# EAGLE design Nanocopter (EAGLE 6.1)
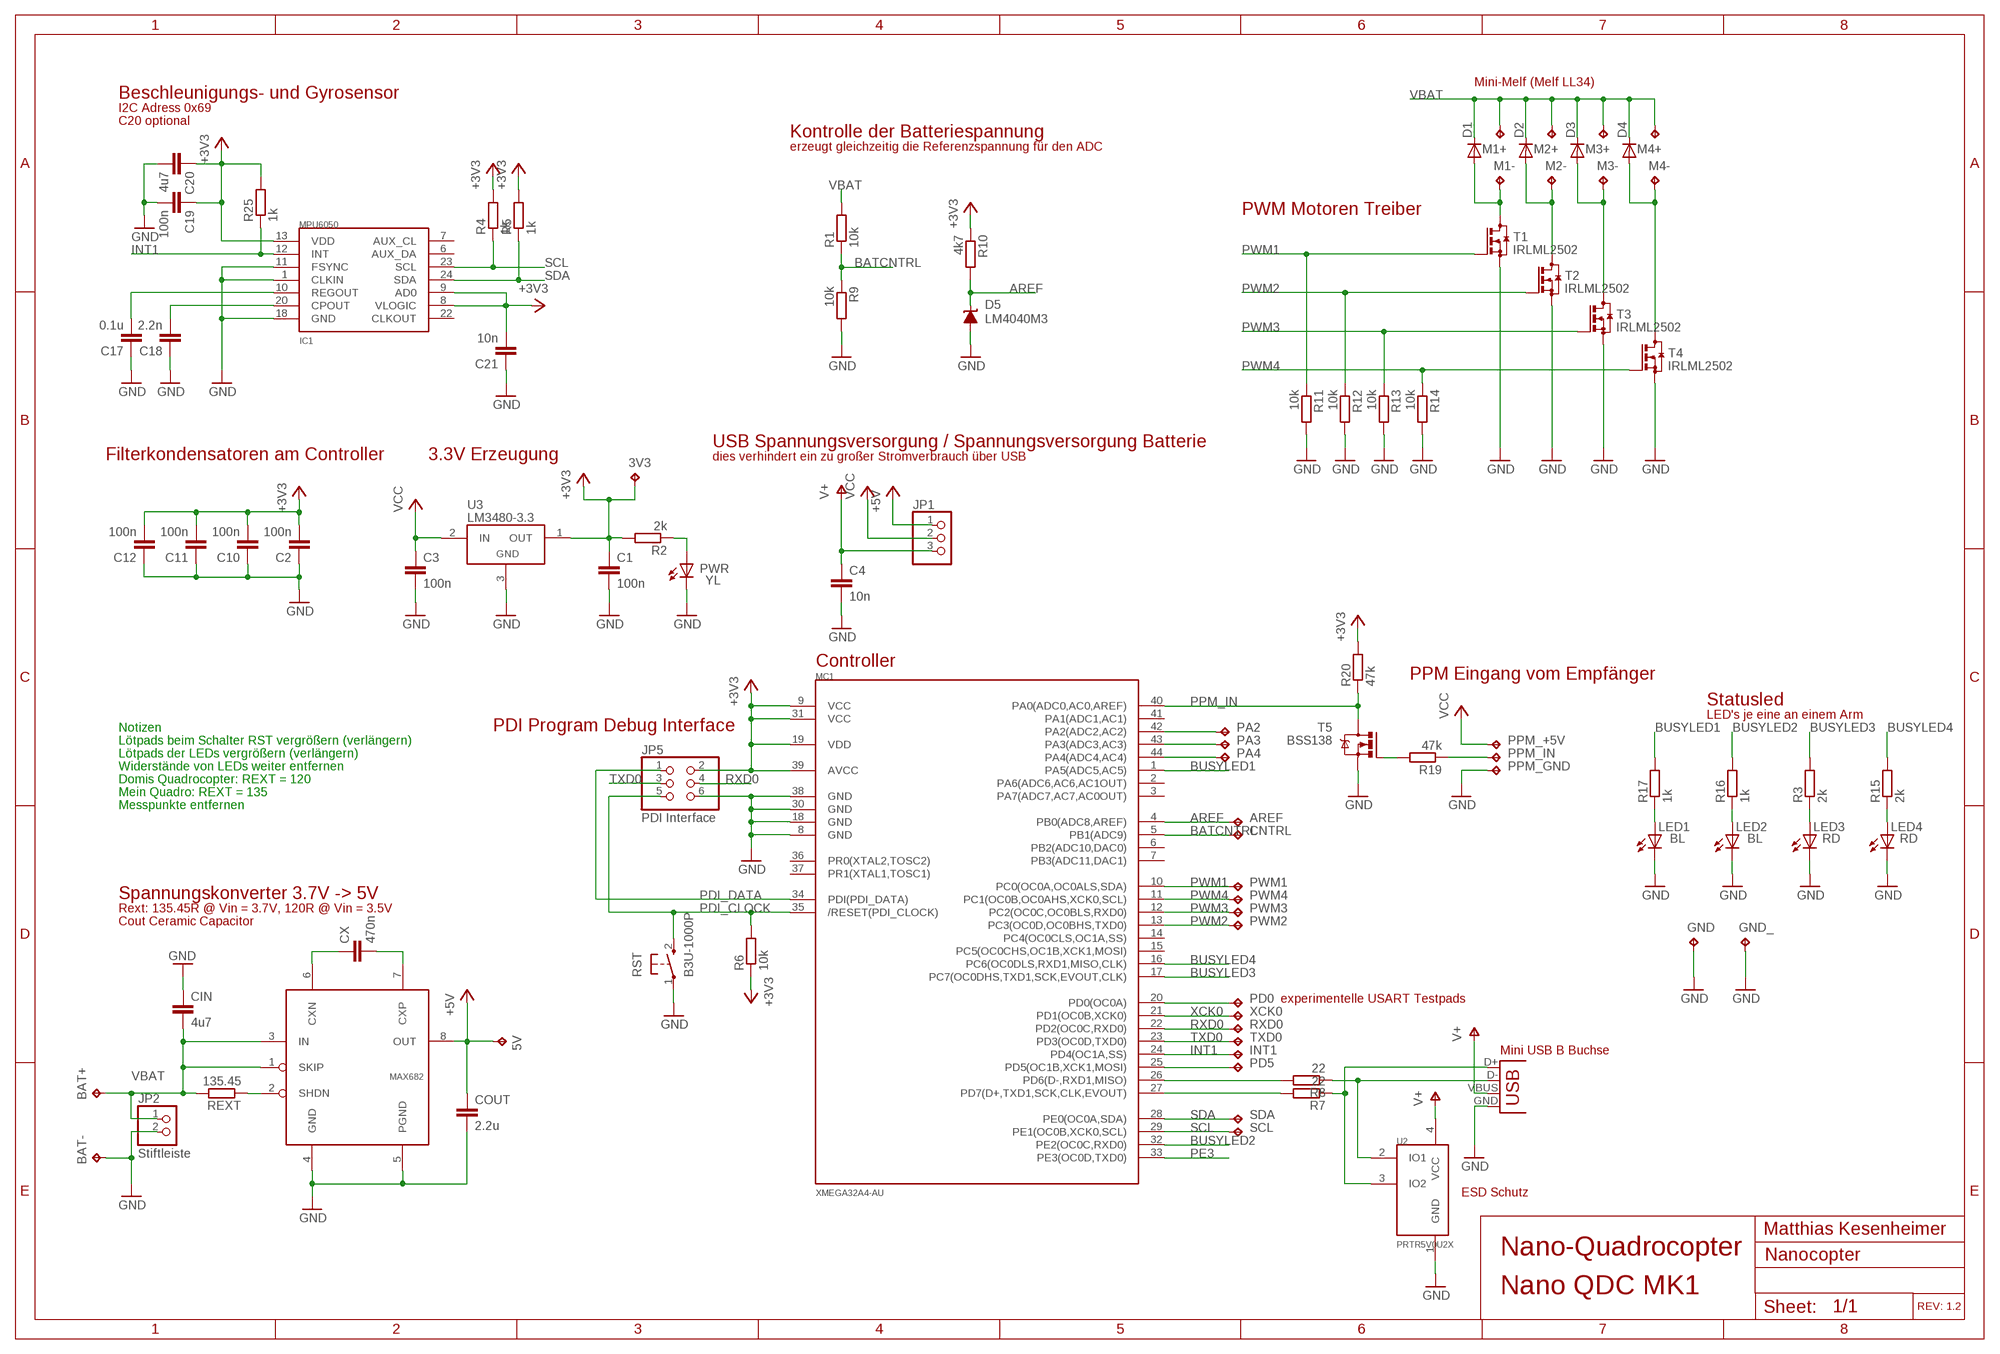
[diagram p0: schematic, sheet 1]

## Parts
3V3  TPTP12SQ  [TP12SQ]
5V  TPTP12SQ  [TP12SQ]
AREF  TPTP10SQ  [TP10SQ]
BAT+  TPTP12SQ  [TP12SQ]
BAT-  TPTP12SQ  [TP12SQ]
C1  100n  C-EUC0603  [C0603]
C2  100n  C-EUC0603  [C0603]
C3  100n  C-EUC0603  [C0603]
C4  10n  C-EUC0603  [C0603]
C10  100n  C-EUC0603  [C0603]
C11  100n  C-EUC0603  [C0603]
C12  100n  C-EUC0603  [C0603]
C17  0.1u  C-EUC0603  [C0603]
C18  2.2n  C-EUC0603  [C0603]
C19  100n  C-EUC0603  [C0603]
C20  4u7  C-EUC0603  [C0603]
C21  10n  C-EUC0603  [C0603]
CIN  4u7  C-EUC1206  [C1206]
CNTRL  TPTP10SQ  [TP10SQ]
COUT  2.2u  C-EUC1206  [C1206]
CX  470n  C-EUC0603  [C0603]
D1  DIODE-MINIMELF  [MINIMELF]
D2  DIODE-MINIMELF  [MINIMELF]
D3  DIODE-MINIMELF  [MINIMELF]
D4  DIODE-MINIMELF  [MINIMELF]
D5  LM4040M3  [SOT-23]
GND  TPTP12SQ  [TP12SQ]
GND_  TPTP12SQ  [TP12SQ]
IC1  MPU6050  [QFN-24]
INT1  TPTP10SQ  [TP10SQ]
JP1  PINHD-1X3  [1X03]
JP2  Stiftleiste  PINHD-1X2  [1X02]
JP5  PDI Interface  PINHD-2X3  [2X03]
LED1  BL  LEDCHIPLED_0603  [CHIPLED_0603]
LED2  BL  LEDCHIPLED_0603  [CHIPLED_0603]
LED3  RD  LEDCHIPLED_0603  [CHIPLED_0603]
LED4  RD  LEDCHIPLED_0603  [CHIPLED_0603]
M1+  TPTP15SQ  [TP15SQ]
M1-  TPTP15SQ  [TP15SQ]
M2+  TPTP15SQ  [TP15SQ]
M2-  TPTP15SQ  [TP15SQ]
M3+  TPTP15SQ  [TP15SQ]
M3-  TPTP15SQ  [TP15SQ]
M4+  TPTP15SQ  [TP15SQ]
M4-  TPTP15SQ  [TP15SQ]
MC1  XMEGA32A4-AU  [TQFP44]
PA2  TPTP10SQ  [TP10SQ]
PA3  TPTP10SQ  [TP10SQ]
PA4  TPTP10SQ  [TP10SQ]
PD0  TPTP10SQ  [TP10SQ]
PD5  TPTP10SQ  [TP10SQ]
PPM_+5V  TPTP10SQ  [TP10SQ]
PPM_GND  TPTP10SQ  [TP10SQ]
PPM_IN  TPTP10SQ  [TP10SQ]
PWM1  TPTP10SQ  [TP10SQ]
PWM2  TPTP10SQ  [TP10SQ]
PWM3  TPTP10SQ  [TP10SQ]
PWM4  TPTP10SQ  [TP10SQ]
PWR  YL  LEDCHIPLED_0603  [CHIPLED_0603]
R1  10k  R-EU_R0603  [R0603]
R2  2k  R-EU_R0603  [R0603]
R3  2k  R-EU_R0603  [R0603]
R4  1k  R-EU_R0603  [R0603]
R5  1k  R-EU_R0603  [R0603]
R6  10k  R-EU_R0603  [R0603]
R7  22  R-EU_R0603  [R0603]
R8  22  R-EU_R0603  [R0603]
R9  10k  R-EU_R0603  [R0603]
R10  4k7  R-EU_R0603  [R0603]
R11  10k  R-EU_R0603  [R0603]
R12  10k  R-EU_R0603  [R0603]
R13  10k  R-EU_R0603  [R0603]
R14  10k  R-EU_R0603  [R0603]
R15  2k  R-EU_R0603  [R0603]
R16  1k  R-EU_R0603  [R0603]
R17  1k  R-EU_R0603  [R0603]
R19  47k  R-EU_R0603  [R0603]
R20  47k  R-EU_R0603  [R0603]
R25  1k  R-EU_R0603  [R0603]
REXT  135.45  R-EU_R0603  [R0603]
RST  B3U-1000P  [SW_SMD]
RXD0  TPTP10SQ  [TP10SQ]
SCL  TPTP10SQ  [TP10SQ]
SDA  TPTP10SQ  [TP10SQ]
T1  IRLML2502  BSS123  [SOT23]
T2  IRLML2502  BSS123  [SOT23]
T3  IRLML2502  BSS123  [SOT23]
T4  IRLML2502  BSS123  [SOT23]
T5  BSS138  [SOT23]
TXD0  TPTP10SQ  [TP10SQ]
U1  MAX682  [SOIC(N)8]
U2  PRTR5V0U2X  [SOT143B]
U3  LM3480-3.3  [SOT-23-3]
X1  USBSMD  [USB-MINIB]
XCK0  TPTP10SQ  [TP10SQ]

## Nets
+3V3: 3V3.TP C1.1 C2.2 C10.2 C11.2 C12.2 C19.1 C20.1 C21.2 IC1.8(VLOGIC) IC1.9(AD0) IC1.13(VDD) JP5.2 MC1.9(VCC) MC1.19(VDD) MC1.31(VCC) MC1.39(AVCC) R2.2 R4.2 R5.2 R6.1 R10.1 R20.2 R25.2 U3.1(OUT)
+5V: 5V.TP COUT.1 JP1.1 U1.8(OUT)
AREF: AREF.TP D5.1(C) MC1.4(PB0(ADC8,AREF)) R10.2
BATCNTRL: CNTRL.TP MC1.5(PB1(ADC9)) R1.1 R9.1
BUSYLED1: MC1.1(PA5(ADC5,AC5)) R17.2
BUSYLED2: MC1.32(PE2(OC0C,RXD0)) R16.2
BUSYLED3: MC1.17(PC7(OC0DHS,TXD1,SCK,EVOUT,CLK)) R3.2
BUSYLED4: MC1.16(PC6(OC0DLS,RXD1,MISO,CLK)) R15.2
D+: MC1.27(PD7(D+,TXD1,SCK,CLK,EVOUT)) R7.2
D-: MC1.26(PD6(D-,RXD1,MISO)) R8.2
GND: BAT-.TP C1.2 C2.1 C3.2 C4.2 C10.1 C11.1 C12.1 C17.1 C18.1 C19.2 C20.2 C21.1 CIN.1 COUT.2 D5.2(A) GND.TP GND_.TP IC1.1(CLKIN) IC1.11(FSYNC) IC1.18(GND) JP2.2 JP5.6 LED1.C LED2.C LED3.C LED4.C MC1.8(GND) MC1.18(GND) MC1.30(GND) MC1.38(GND) PPM_GND.TP PWR.C R9.2 R11.2 R12.2 R13.2 R14.2 RST.1 T1.2(S) T2.2(S) T3.2(S) T4.2(S) T5.2(S) U1.4(GND) U1.5(PGND) U2.1(GND) U3.3(GND) X1.GND
INT1: IC1.12(INT) INT1.TP MC1.24(PD4(OC1A,SS)) R25.1
N$2: R19.2 T5.1(G)
N$3: PPM_IN.TP R19.1
N$4: MC1.44(PA4(ADC4,AC4)) PA4.TP
N$6: CX.1 U1.6(CXN)
N$7: MC1.43(PA3(ADC3,AC3)) PA3.TP
N$8: MC1.42(PA2(ADC2,AC2)) PA2.TP
N$9: PWR.A R2.1
N$10: LED3.A R3.1
N$11: REXT.1 U1.2(SHDN)
N$13: CX.2 U1.7(CXP)
N$15: LED4.A R15.1
N$17: LED2.A R16.1
N$18: LED1.A R17.1
N$19: D1.A M1-.TP T1.3(D)
N$21: D3.A M3-.TP T3.3(D)
N$22: D4.A M4-.TP T4.3(D)
N$26: C17.2 IC1.10(REGOUT)
N$27: C18.2 IC1.20(CPOUT)
N$30: D2.A M2-.TP T2.3(D)
N$35: MC1.20(PD0(OC0A)) PD0.TP
N$36: MC1.25(PD5(OC1B,XCK1,MOSI)) PD5.TP
PDI_CLOCK: JP5.5 MC1.35(/RESET(PDI_CLOCK)) R6.2 RST.2
PDI_DATA: JP5.1 MC1.34(PDI(PDI_DATA))
PE3: MC1.33(PE3(OC0D,TXD0))
PPM_IN: MC1.40(PA0(ADC0,AC0,AREF)) R20.1 T5.3(D)
PWM1: MC1.10(PC0(OC0A,OC0ALS,SDA)) PWM1.TP R11.1 T1.1(G)
PWM2: MC1.13(PC3(OC0D,OC0BHS,TXD0)) PWM2.TP R12.1 T2.1(G)
PWM3: MC1.12(PC2(OC0C,OC0BLS,RXD0)) PWM3.TP R13.1 T3.1(G)
PWM4: MC1.11(PC1(OC0B,OC0AHS,XCK0,SCL)) PWM4.TP R14.1 T4.1(G)
RXD0: JP5.4 MC1.22(PD2(OC0C,RXD0)) RXD0.TP
SCL: IC1.23(SCL) MC1.29(PE1(OC0B,XCK0,SCL)) R4.1 SCL.TP
SDA: IC1.24(SDA) MC1.28(PE0(OC0A,SDA)) R5.1 SDA.TP
TXD0: JP5.3 MC1.23(PD3(OC0D,TXD0)) TXD0.TP
USB+: R7.1 U2.3(IO2) X1.D+
USB-: R8.1 U2.2(IO1) X1.D-
V+: C4.1 JP1.3 U2.4(VCC) X1.VBUS
VBAT: BAT+.TP CIN.2 D1.C D2.C D3.C D4.C JP2.1 M1+.TP M2+.TP M3+.TP M4+.TP R1.2 REXT.2 U1.1(SKIP) U1.3(IN)
VCC: C3.1 JP1.2 PPM_+5V.TP U3.2(IN)
XCK0: MC1.21(PD1(OC0B,XCK0)) XCK0.TP
Unconnected: IC1.6(AUX_DA) IC1.7(AUX_CL) IC1.22(CLKOUT) MC1.2(PA6(ADC6,AC6,AC1OUT)) MC1.3(PA7(ADC7,AC7,AC0OUT)) MC1.6(PB2(ADC10,DAC0)) MC1.7(PB3(ADC11,DAC1)) MC1.14(PC4(OC0CLS,OC1A,SS)) MC1.15(PC5(OC0CHS,OC1B,XCK1,MOSI)) MC1.36(PR0(XTAL2,TOSC2)) MC1.37(PR1(XTAL1,TOSC1)) MC1.41(PA1(ADC1,AC1))

## Notes on the sheet
- Mini-Melf (Melf LL34)
- Beschleunigungs- und Gyrosensor
- I2C Adress 0x69
- C20 optional
- Kontrolle der Batteriespannung
- erzeugt gleichzeitig die Referenzspannung für den ADC
- PWM Motoren Treiber
- USB Spannungsversorgung / Spannungsversorgung Batterie
- Filterkondensatoren am Controller | 3.3V Erzeugung | dies verhindert ein zu großer Stromverbrauch über USB
- Controller
- PPM Eingang vom Empfänger
- Statusled
- LED's je eine an einem Arm
- Notizen | PDI Program Debug Interface
- Lötpads beim Schalter RST vergrößern (verlängern)
- Lötpads der LEDs vergrößern (verlängern)
- Widerstände von LEDs weiter entfernen
- Domis Quadrocopter: REXT = 120
- Mein Quadro: REXT = 135
- Messpunkte entfernen
- Spannungskonverter 3.7V -> 5V
- Rext: 135.45R @ Vin = 3.7V, 120R @ Vin = 3.5V
- Cout Ceramic Capacitor
- experimentelle USART Testpads
- Mini USB B Buchse
- ESD Schutz
- Matthias Kesenheimer
- Nano-Quadrocopter
- Nano QDC MK1
- REV: 1.2

## Library data of the parts
3V3 5V AREF BAT+ BAT- CNTRL GND GND_ INT1 M1+ M1- M2+ M2- M3+ M3- M4+ M4- PA2-PA4 PD0 PD5 PPM_+5V PPM_GND PPM_IN PWM1-PWM4 RXD0 SCL SDA TXD0 XCK0 = testpad:TP: Test pad
C1-C4 C10-C12 C17-C21 CIN COUT CX = rcl:C-EU: CAPACITOR, European symbol
D1-D4 = diode:DIODE-: DIODE
D5 = texas:LM4040M3
IC1 = SparkFun:MPU6050
JP1 = pinhead:PINHD-1X3: PIN HEADER
JP2 = pinhead:PINHD-1X2: PIN HEADER
JP5 = pinhead:PINHD-2X3: PIN HEADER
LED1-LED4 PWR = led:LED: LED OSRAM: - CHIPLED LG R971, LG N971, LY N971, LG Q971, LY Q971, LO R971, LY R971 LH N974, LH R974 LS Q976, LO Q976, LY Q976 LO Q996 - Hyper CHIPLED LW Q18S LB Q993, LB Q99A, LB R99A - SideLED LS A670, LO A670, LY A670, LG A670, LP A670 LB A673, LV A673, LT A673, LW A673 LH A674 LY A675 LS A676, LA A676, LO A676, LY A676, LW A676 LS A679, LY A679, LG A679 - Hyper Micro SIDELED® LS Y876, LA Y876, LO Y876, LY Y876 LT Y87S - SmartLED LW L88C, LW L88S LB L89C, LB L89S, LG L890 LS L89K, LO L89K, LY L89K LS L896, LA L896, LO L896, LY L896 - TOPLED LS T670, LO T670, LY T670, LG T670, LP T670 LSG T670, LSP T670, LSY T670, LOP T670, LYG T670 LG T671, LOG T671, LSG T671 LB T673, LV T673, LT T673, LW T673 LH T674 LS T676, LA T676, LO T676, LY T676, LB T676, LH T676, LSB T676, LW T676 LB T67C, LV T67C, LT T67C, LS T67K, LO T67K, LY T67K, LW E67C LS E67B, LA E67B, LO E67B, LY E67B, LB E67C, LV E67C, LT E67C LW T67C LS T679, LY T679, LG T679 LS T770, LO T770, LY T770, LG T770, LP T770 LB T773, LV T773, LT T773, LW T773 LH T774 LS E675, LA E675, LY E675, LS T675 LS T776, LA T776, LO T776, LY T776, LB T776 LHGB T686 LT T68C, LB T68C - Hyper Mini TOPLED® LB M676 - Mini TOPLED Santana® LG M470 LS M47K, LO M47K, LY M47K Source: http://www.osram.convergy.de LUXEON: - LUMILED® LXK2-PW12-R00, LXK2-PW12-S00, LXK2-PW14-U00, LXK2-PW14-V00 LXK2-PM12-R00, LXK2-PM12-S00, LXK2-PM14-U00 LXK2-PE12-Q00, LXK2-PE12-R00, LXK2-PE12-S00, LXK2-PE14-T00, LXK2-PE14-U00 LXK2-PB12-K00, LXK2-PB12-L00, LXK2-PB12-M00, LXK2-PB14-N00, LXK2-PB14-P00, LXK2-PB14-Q00 LXK2-PR12-L00, LXK2-PR12-M00, LXK2-PR14-Q00, LXK2-PR14-R00 LXK2-PD12-Q00, LXK2-PD12-R00, LXK2-PD12-S00 LXK2-PH12-R00, LXK2-PH12-S00 LXK2-PL12-P00, LXK2-PL12-Q00, LXK2-PL12-R00 Source: www.luxeon.com KINGBRIGHT: KA-3528ASYC Source: www.kingbright.com
MC1 = atmel:XMEGA32A4-AU
R1-R17 R19 R20 R25 REXT = rcl:R-EU_: RESISTOR, European symbol
RST = Omron:B3U-1000P
T1-T4 = transistor-small-signal:BSS123: N-CHANNEL MOS FET
T5 = mylib:BSS138
U1 = maxim:MAX682
U2 = Philips:PRTR5V0U2X
U3 = regulators:LM3480-*: National Semiconductor LM3480 100 mA, SOT-23, quasi-LDO linear regulator
X1 = SparkFun:USB: USB Connectors USB-B-PTH is fully proven SKU : PRT-00139 USB-miniB is fully proven SKU : PRT-00587 USB-A-PCB is untested. USB-A-H is throughly reviewed, but untested. Spark Fun Electronics SKU : PRT-00437 USB-B-SMT is throughly reviewed, but untested. Needs silkscreen touching up. USB-A-S has not been used/tested USB-MB-H has not been used/tested

## Board
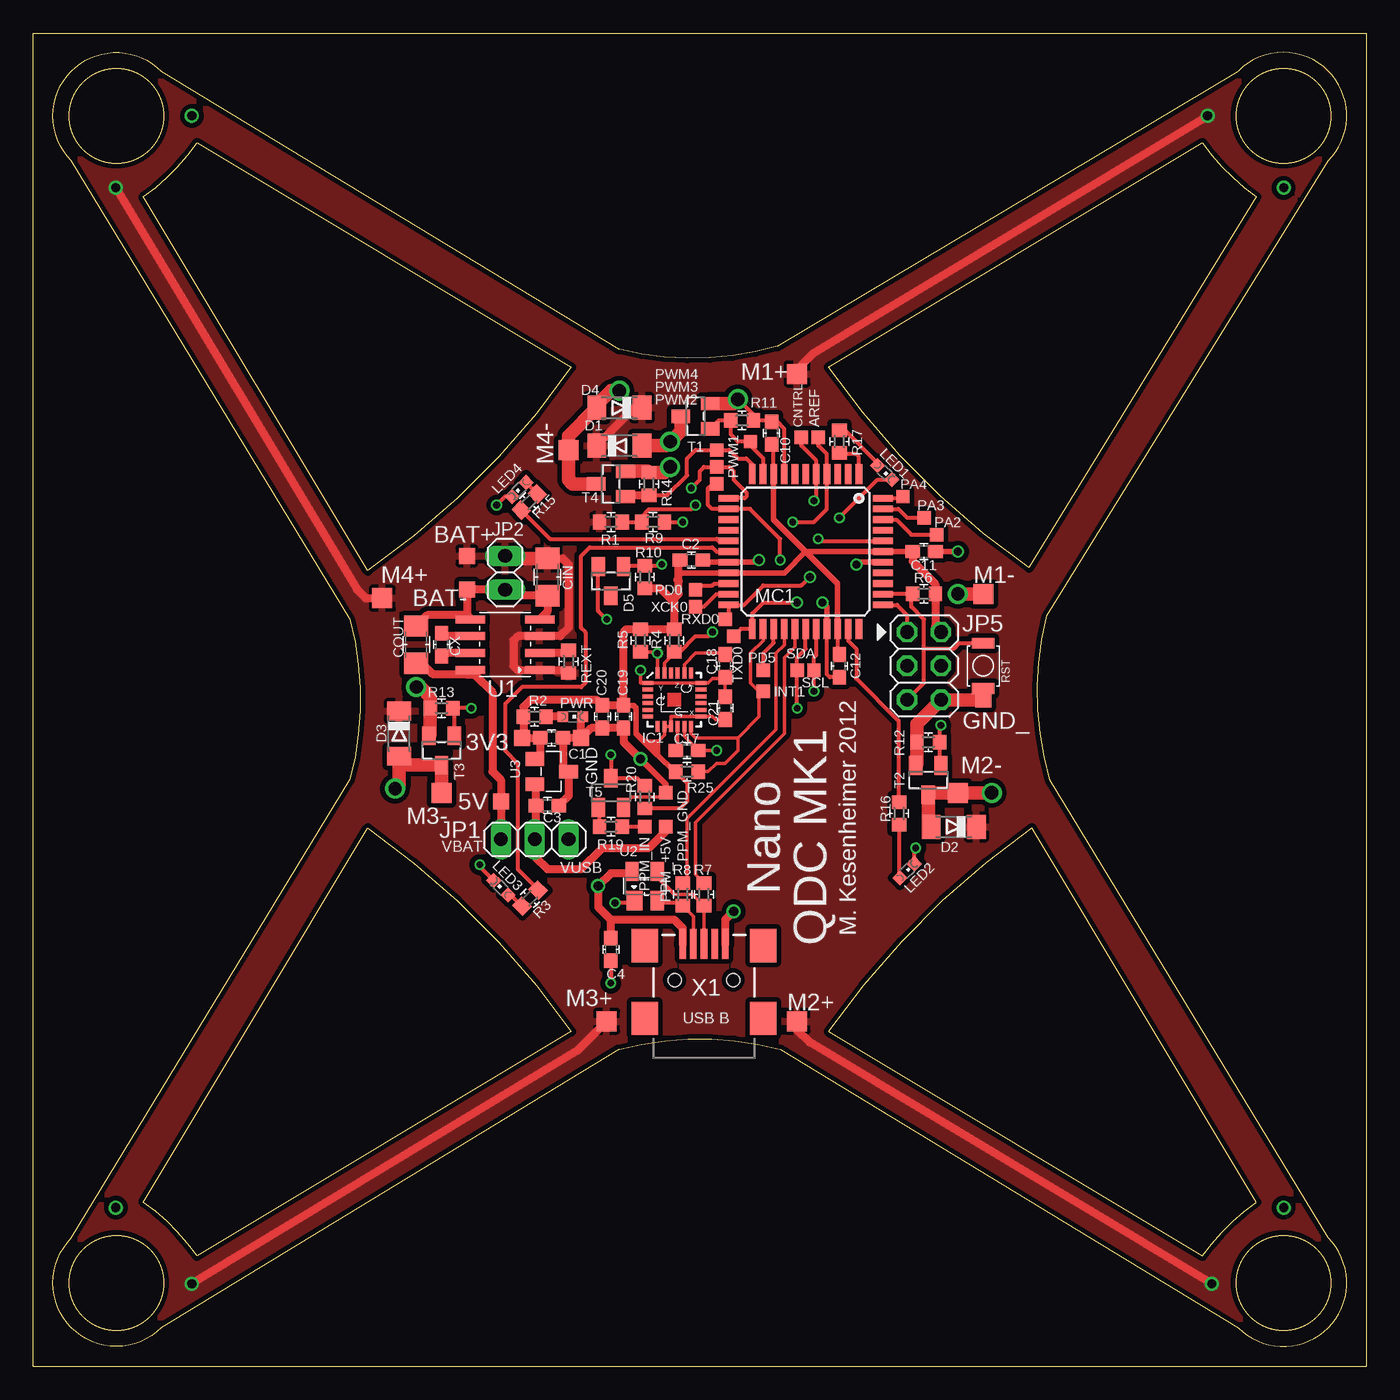
[diagram p1: board, top side]
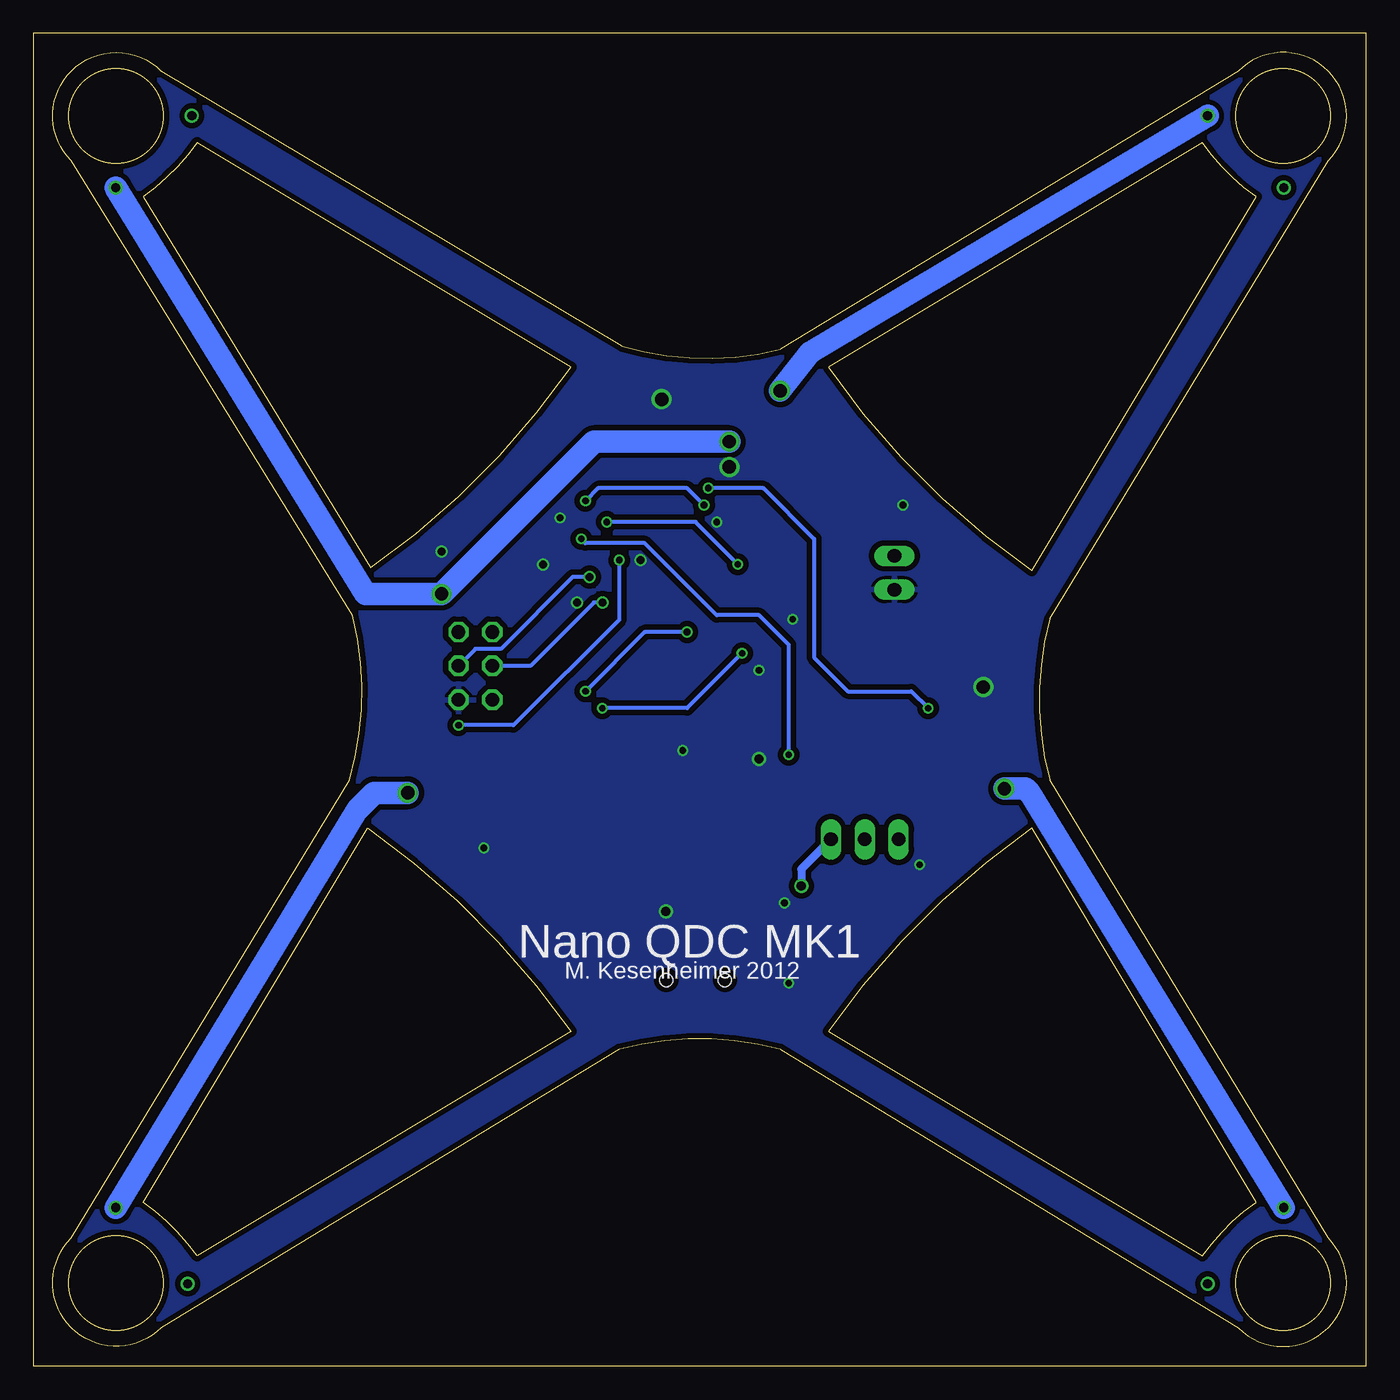
[diagram p2: board, bottom side, seen from below]

Size 100 x 100 mm. Coordinates in mm from the lower left corner, seen from the top.
Outline: 43.94,23.76 arc-30 56.07,23.76 90.41,2.88 arc90 97.15,2.88 arc90 97.15,9.61 76.27,43.96 arc-30 76.05,56.31 97.15,90.44 arc90 97.15,97.17 arc90 90.41,97.17 55.84,76.52 arc-30 43.94,76.29 9.59,97.17 arc90 2.86,97.17 arc90 2.86,90.44 23.74,56.09 arc-30 23.74,43.96 2.86,9.61 arc90 2.86,2.88 arc90 9.59,2.88 43.94,23.76
Outline: 87.72,8.27 arc-20 91.76,12.31 74.92,40.37 arc20 59.66,25.11 87.72,8.27
Outline: 74.7,59.9 arc-20 59.66,74.95 87.72,91.78 arc20 91.76,87.74 74.7,59.9
Outline: 40.35,74.95 arc-20 25.08,59.68 8.25,87.74 arc20 12.29,91.78 40.35,74.95
Outline: 25.08,40.37 arc-20 40.35,25.11 12.29,8.27 arc20 8.25,12.31 25.08,40.37
Outline: 0,0 0,100 100,100 100,0 0,0
Outline: circle at 93.78,93.81 radius 3.55
Outline: circle at 93.78,6.25 radius 3.55
Outline: circle at 6.22,93.81 radius 3.55
Outline: circle at 6.22,6.25 radius 3.55
Copper layers (1*16): Top 0.035mm / dielectric 1.5mm / Bottom 0.035mm
Design rules "default": minimum track width 6mil, minimum drill 12mil, track to track 6mil, track to pad 6mil, pad to pad 6mil, via to via 6mil, smd to smd 0mil, copper to edge 10mil, drill to drill 10mil, minimum pad ring 10mil, minimum via ring 6mil, stop-mask expansion 2mil, vias tented up to drill 100mil, thermal gap 10mil

### Footprints (pad centres in the part's own frame; a part is rotated, then mirrored left to right if it is on the bottom)
TP12SQ = smd 1.2 x 1.2: TP 0,0
TP10SQ = smd 1 x 1: TP 0,0
C0603 = smd 1.1 x 1: 1 -0.85,0; 2 0.85,0
C1206 = smd 1.6 x 1.8: 1 -1.4,0; 2 1.4,0
MINIMELF = smd 1.4 x 1.8: A 1.7,0; C -1.7,0
SOT-23 = smd 1 x 1.4: 1 -0.95,-1.1; 2 0.95,-1.1; 3 0,1.1
QFN-24 = smd 0.8 x 0.3: 1 -2,1.25; 2 -2,0.75; 3 -2,0.25; 4 -2,-0.25; 5 -2,-0.75; 6 -2,-1.25; 13 2,-1.25; 14 2,-0.75; 15 2,-0.25; 16 2,0.25; 17 2,0.75; 18 2,1.25 | smd 0.3 x 0.8: 7 -1.25,-2; 8 -0.75,-2; 9 -0.25,-2; 10 0.25,-2; 11 0.75,-2; 12 1.25,-2; 19 1.25,2; 20 0.75,2; 21 0.25,2; 22 -0.25,2; 23 -0.75,2; 24 -1.25,2
1X03 = drill 1.016 long: 1 -2.54,0; 2 0,0; 3 2.54,0
1X02 = drill 1.016 long: 1 -1.27,0; 2 1.27,0
2X03 = drill 1.016 octagon: 1 -2.54,-1.27; 2 -2.54,1.27; 3 0,-1.27; 4 0,1.27; 5 2.54,-1.27; 6 2.54,1.27
CHIPLED_0603 = smd 0.8 x 0.8: A 0,-0.75; C 0,0.75
TP15SQ = smd 1.5 x 1.5: TP 0,0
TQFP44 = smd 1.5 x 0.5: 1 -5.8,4; 2 -5.8,3.2; 3 -5.8,2.4; 4 -5.8,1.6; 5 -5.8,0.8; 6 -5.8,0; 7 -5.8,-0.8; 8 -5.8,-1.6; 9 -5.8,-2.4; 10 -5.8,-3.2; 11 -5.8,-4; 23 5.8,-4; 24 5.8,-3.2; 25 5.8,-2.4; 26 5.8,-1.6; 27 5.8,-0.8; 28 5.8,0; 29 5.8,0.8; 30 5.8,1.6; 31 5.8,2.4; 32 5.8,3.2; 33 5.8,4 | smd 0.5 x 1.5: 12 -4,-5.8; 13 -3.2,-5.8; 14 -2.4,-5.8; 15 -1.6,-5.8; 16 -0.8,-5.8; 17 0,-5.8; 18 0.8,-5.8; 19 1.6,-5.8; 20 2.4,-5.8; 21 3.2,-5.8; 22 4,-5.8; 34 4,5.8; 35 3.2,5.8; 36 2.4,5.8; 37 1.6,5.8; 38 0.8,5.8; 39 0,5.8; 40 -0.8,5.8; 41 -1.6,5.8; 42 -2.4,5.8; 43 -3.2,5.8; 44 -4,5.8
R0603 = smd 1 x 1.1: 1 -0.85,0; 2 0.85,0
SW_SMD = smd 0.8 x 1.7: 1 -1.7,0; 2 1.7,0
SOT23 = smd 1 x 1.4: 1 -0.95,-1.1; 2 0.95,-1.1; 3 0,1.1
SOIC(N)8 = smd 2.2 x 0.6: 1 -2.6,1.905; 2 -2.6,0.635; 3 -2.6,-0.635; 4 -2.6,-1.905; 5 2.6,-1.905; 6 2.6,-0.635; 7 2.6,0.635; 8 2.6,1.905
SOT143B = smd 1.2 x 1.44: 1 -0.75,-1.1 | smd 1 x 1.44: 2 0.95,-1.1; 3 0.95,1.1; 4 -0.95,1.1
SOT-23-3 = smd 1.016 x 1.397: 1 -0.953,-1.27; 2 0.953,-1.27; 3 0,1.27
USB-MINIB = smd 2.25 x 0.5: D+ 2.625,0; D- 2.625,0.8; GND 2.625,-1.6; ID 2.625,-0.8; VBUS 2.625,1.6 | smd 2.5 x 2: MTN1 -2.95,4.45; MTN2 2.5,4.45; MTN3 -2.95,-4.45; MTN4 2.5,-4.45 | hole 1: -0.07,2.2; -0.07,-2.2

### Placement (x,y rotation side)
3V3  36.66,47.14 90 top
5V  35.08,42.38 90 top
AREF  58.89,69.68 0 top
BAT+  32.54,60.79 0 top
BAT-  32.54,58.25 0 top
C1  38.89,47.14 0 top
C2  49.36,60.48 180 top
C3  38.57,42.06 0 top
C4  43.33,31.27 270 top
C10  55.4,70 270 top
C11  66.83,61.11 180 top
C12  60.48,52.54 90 top
C17  49.05,46.19 180 top
C18  51.9,52.54 90 top
C19  44.28,48.73 270 top
C20  42.7,48.73 270 top
C21  51.9,49.36 270 top
CIN  38.57,59.21 90 top
CNTRL  57.62,69.68 0 top
COUT  28.73,54.13 90 top
CX  30.63,54.13 270 top
D1  43.97,69.05 0 top
D2  69.05,40.47 180 top
D3  27.46,47.46 270 top
D4  43.97,71.91 180 top
D5  43.33,58.89 180 top
GND  41.11,47.14 90 top
GND_  71.27,50 0 top
IC1  48.09,50 0 top
INT1  54.76,50.63 0 top
JP1  37.62,39.52 0 top
JP2  35.39,59.52 270 top
JP5  66.83,52.54 270 top
LED1  63.88,67.05 225 top
LED2  65.56,37.17 315 top
LED3  35.08,35.9 45 top
LED4  36.44,65.78 135 top
M1+  57.3,74.45 0 top
M1-  71.27,57.94 0 top
M2+  57.3,25.87 0 top
M2-  69.37,43.01 0 top
M3+  43.01,25.87 0 top
M3-  30.63,43.01 0 top
M4+  26.19,57.62 0 top
M4-  40.16,68.73 0 top
MC1  57.94,61.11 270 top
PA2  67.78,62.38 0 top
PA3  66.83,63.65 0 top
PA4  65.24,65.24 0 top
PD0  49.68,58.25 0 top
PD5  54.76,52.22 0 top
PPM_+5V  47.46,40.47 90 top
PPM_GND  47.46,43.01 0 top
PPM_IN  45.87,40.47 0 top
PWM1  53.81,69.37 0 top
PWM2  51.27,66.19 0 top
PWM3  51.27,67.46 0 top
PWM4  51.27,68.73 0 top
PWR  40.47,48.73 270 top
R1  43.33,63.33 180 top
R2  37.62,48.73 180 top
R3  37.26,35.12 45 top
R4  48.09,54.44 90 top
R5  45.55,54.44 90 top
R6  66.83,57.94 180 top
R7  50.32,35.39 90 top
R8  48.73,35.39 90 top
R9  46.51,63.33 0 top
R10  45.87,59.21 90 top
R11  53.17,70.95 0 top
R12  67.14,46.82 180 top
R13  30.63,49.36 180 top
R14  46.19,66.19 90 top
R15  37.21,64.83 225 top
R16  64.96,41.47 90 top
R17  60.48,69.37 270 top
R19  43.33,40.47 180 top
R20  45.87,42.7 270 top
R25  49.05,44.6 180 top
REXT  40.16,52.86 270 top
RST  71.27,52.54 90 top
RXD0  51.9,56.03 0 top
SCL  58.57,52.22 0 top
SDA  57.3,52.22 0 top
T1  49.68,71.27 90 top
T2  67.14,43.97 180 top
T3  30.63,46.19 180 top
T4  43.33,66.19 90 top
T5  43.33,43.01 0 top
TXD0  52.54,54.76 0 top
U1  35.39,54.13 180 top
U2  45.87,36.03 0 top
U3  38.89,44.6 270 top
X1  50.32,29.04 90 top
XCK0  49.68,56.98 0 top

### Tracks (layer width: path | path; a pad name or v marks a point on that pad's centre or on a via)
+3V3
  Top 0.254: C21.2 51.17,48.51 50.95,48.73 50.11,48.73 IC1.13 47.84,48.75 IC1.9 IC1.8 47.34,47.34 46.82,46.82 | 48.09,44.6 R25.2
  Top 0.305: MC1.31 60.34,53.53 C12.2 | MC1.9 55.54,69.01 C10.2 | R20.2 48.51,41.85 49.05,42.38 49.05,43.75 R25.2
  Top 0.406: MC1.9 55.54,63.51 57.94,61.11 | 57.94,61.11 MC1.39 C11.2 | MC1.31 60.34,58.71 57.94,61.11 | C19.1 45.02,49.58 45.24,49.36 45.24,47.46 45.87,46.82 | 45.87,46.82 46.82,46.82 46.82,46.19 | 46.82,45.87 48.09,44.6 | 45.87,46.82 46.82,45.87 | 46.82,46.19 46.82,45.87 | 57.94,61.11 56.34,59.51 MC1.19 48.42,59.51 48.41,59.52 | 46.82,46.19 46.51,46.51 | 48.41,60.37 C2.2
  Top 0.61: C11.2 65.98,60.37 67.68,58.67 R6.1 67.68,55.5 JP5.2 | 48.09,57.3 R4.2 R5.2 44.5,55.29 44.28,55.08 C19.1 C20.1 42.28,50 37.3,50 36.77,49.47 R2.2 36.77,47.24 3V3.TP C1.1 38.04,45.97 U3.1 | 48.09,57.3 48.09,57.62 48.41,57.94 48.41,58.89 | 48.41,58.89 48.41,59.52 48.41,60.37 | C2.2 48.41,60.58 | 48.41,58.89 48.31,58.99 | R10.1 47.04,58.36 48.09,57.3
+5V
  Top 0.406: COUT.1 28.41,52.41
  Top 0.61: JP1.1 5V.TP 35.08,43.97 34.44,44.6 34.44,50.57 33.11,51.9 32.48,51.9 | COUT.1 29.17,52.73 30,51.9 32.22,51.9 32.48,51.9 | U1.8 32.48,51.9
AREF  (via drill 0.5)
  Top 0.305: v56.98,63.33 58.57,63.33 59.54,64.3 MC1.4 59.52,66.92 59.52,68.41 58.89,69.05 AREF.TP | D5.1 44.35,60.06 R10.2 47.04,60.06 v47.14,60.16
  Bottom 0.305: v56.98,63.33 50.32,63.33 v47.14,60.16
BATCNTRL  (via drill 0.5)
  Top 0.305: v58.57,64.92 58.74,65.09 MC1.5 58.74,67.93 57.62,69.05 CNTRL.TP | R1.1 R9.1 45.66,63.75 46.19,64.29 49.36,64.29 v49.68,64.6
  Bottom 0.305: v49.68,64.6 50.95,65.87 57.62,65.87 v58.57,64.92
BUSYLED1
  Top 0.305: MC1.1 61.94,68.22 61.75,68.41 60.48,68.41 | 60.16,68.41 60.48,68.41 | 60.48,68.41 R17.2 60.48,68.73
BUSYLED2
  Top 0.305: MC1.32 61.14,54.42 61.75,53.81 61.75,51.59 64.92,48.41 64.92,42.38 64.96,42.34 R16.2
BUSYLED3
  Top 0.305: MC1.17 51.27,61.11 50.95,61.43 41.74,61.43 41.11,60.79 41.11,55.4 41.43,55.08 41.43,51.27 41.11,50.95 36.66,50.95 35.39,49.68 35.39,46.19 36.35,45.24 36.35,37.3 37.86,35.78 R3.2
BUSYLED4
  Top 0.305: MC1.16 51.42,61.91 51.27,62.06 38.77,62.06 R15.2
D+
  Top 0.254: MC1.27 57.14,53.96 56.35,53.17 56.35,47.46 49.68,40.79 49.68,36.88 R7.2
D-
  Top 0.254: MC1.26 56.34,54.11 55.71,53.49 55.71,47.78 49.05,41.11 49.05,36.66 48.73,36.35 R8.2 48.73,36.03
GND  (via drill 0.5, 0.6, 0.7, 1)
  Top 0.254: C21.1 C18.1 51.8,51.59 50.95,51.59 50.61,51.25 IC1.18 IC1.1 45.57,51.25 45.55,51.27 v45.55,52.22 | IC1.11 48.84,47.24 C17.1 v51.27,46.19 | 44.28,42.06 44.92,42.7 47.14,42.7 PPM_GND.TP
  Top 0.305: C12.1 59.74,51.69 59.52,51.9 59.52,55.3 MC1.30 | MC1.8 56.35,66.92 56.35,70.32 55.82,70.85 C10.1 55.29,70.95 R11.2 54.02,71.37 v52.86,72.54 | R12.2 66.19,46.72 | 44.28,42.06 T5.2 | R9.2 v48.73,63.33 | D5.2 42.38,56.66 v43.01,56.03 | LED3.C 33.49,37.49 v33.49,37.62 | LED4.C 35.41,65.25 v34.76,64.6 | v60.48,63.65 63.33,66.51 64.4,66.51 LED1.C | U2.1 44.95,34.76 v43.65,34.76 | C4.2 v43.33,28.73 | LED2.C 66.09,38.78 v66.19,38.89
  Top 0.406: MC1.30 59.54,56.97 v59.21,57.3 | MC1.38 61.9,60.31 v61.75,60.16 | v54.44,60.48 54.28,60.31 MC1.18 50.38,60.31 C2.1 | C11.1 v69.37,61.11 | v45.55,45.55 47.46,43.65 PPM_GND.TP | RST.1 GND_.TP
  Top 0.61: T2.2 66.29,45.17 | 46.09,67.14 R14.2 | v45.55,45.55 44.28,46.82 C19.2 C20.2 41.85,47.88 GND.TP | 32.54,56.35 BAT-.TP JP2.2 35.84,57.81 CIN.1 38.57,56.61 U1.4 | 32.54,56.35 32.54,56.29 U1.5 32.79,56.09 32.54,56.35 | GND.TP C1.2 39.74,45.02 U3.3 40.16,42.8 C3.2 | GND.TP 41.11,48.61 PWR.C | 29.78,47.39 T3.2 | COUT.2 29.55,56.35 32.54,56.35 | X1.GND 51.92,33.5 v52.54,34.12
  Top 1.016: 66.29,45.17 R12.2 66.29,48.2 JP5.6 GND_.TP | T1.2 52.54,72.22 v52.86,72.54 | R14.2 47.36,67.04 v47.78,67.46 | T4.2 46.09,67.14 | 29.78,47.39 R13.2 29.78,50.21 29.04,50.95 v28.73,50.95
  pour Bottom (isolate 0.406): 100,0 0,0 0,100 100,100
INT1
  Top 0.254: 49.36,47.98 IC1.12 49.34,47.48 49.68,47.14 52.86,47.14 | R25.1 50.63,44.6 51.27,45.24 51.9,45.24 52.86,46.19 52.86,47.14 | MC1.24 54.76,55.29 54.76,54.44 53.81,53.49 53.81,51.27 54.44,50.63 54.44,48.73 52.86,47.14
  Top 0.305: 54.44,50.63 INT1.TP
N$2
  Top 0.305: R19.2 42.48,41.81 T5.1
N$3
  Top 0.305: PPM_IN.TP R19.1
N$4
  Top 0.305: MC1.44 65.11,65.11 PA4.TP
N$6
  Top 0.61: U1.6 30.85,54.76 CX.1
N$7
  Top 0.305: MC1.43 64.9,64.31 65.56,63.65 PA3.TP
N$8
  Top 0.305: MC1.42 64.74,63.51 65.87,62.38 PA2.TP
N$9
  Top 0.61: PWR.A R2.1
N$10
  Top 0.305: R3.1 35.81,35.37 LED3.A
N$11
  Top 0.61: U1.2 39.94,53.49 REXT.1
N$13
  Top 0.61: U1.7 30.85,53.49 CX.2
N$15
  Top 0.305: R15.1 37.81,65.47 LED4.A
N$17
  Top 0.305: R16.1 64.96,36.7 64.92,36.66 65,36.66 LED2.A
N$18
  Top 0.305: LED1.A 63.35,67.77 60.9,70.22 R17.1
N$19  (via drill 0.7, 1)
  Top 1.016: T1.3 48.58,70.17 v47.78,69.37 47.46,69.05 D1.A | v69.37,57.94 M1-.TP
  Bottom 1.676: v47.78,69.37 57.94,69.37 v69.37,57.94 75.08,57.94 v93.81,88.42
N$21  (via drill 0.7, 1)
  Top 1.016: v27.14,43.33 27.46,43.65 D3.A 28.13,45.09 T3.3 M3-.TP
  Bottom 1.676: v27.14,43.33 25.55,43.33 25.23,43.01 v6.18,11.9
N$22  (via drill 0.7, 1)
  Top 1.016: T4.3 40.47,66.19 40.16,66.51 M4-.TP 40.16,69.8 D4.A 42.38,71.91 42.38,72.22 43.33,73.18 v43.97,73.18
  Bottom 1.676: v43.97,73.18 41.74,76.03 v11.9,93.81
N$26
  Top 0.254: IC1.10 48.34,46.34 C17.2
N$27
  Top 0.254: IC1.20 48.84,52.65 49.68,53.49 51.8,53.49 C18.2
N$30  (via drill 0.7, 1)
  Top 1.016: v71.91,43.01 M2-.TP 67.29,43.01 T2.3 67.14,40.68 D2.A
  Bottom 1.676: v71.91,43.01 74.45,43.01 75.72,41.74 v93.81,11.9
N$35
  Top 0.305: MC1.20 51.09,58.71 50.95,58.57 50,58.57 PD0.TP
N$36
  Top 0.305: MC1.25 55.54,54.27 54.76,53.49 PD5.TP
PDI_CLOCK
  Top 0.305: MC1.35 63.76,57.94 R6.2 65.87,57.83 65.87,56.98 66.83,56.03 66.83,53.81 | 66.83,53.81 66.83,51.27 JP5.5 | 66.83,53.81 69.05,53.81 69.48,54.24 RST.2
PDI_DATA
  Top 0.305: MC1.34 64.79,57.11 65.56,56.35 JP5.1
PPM_IN  (via drill 0.5)
  Top 0.305: MC1.40 59.04,61.91 v58.89,62.06 | R20.1 45.3,44.11 T5.3 v43.33,45.87
  Bottom 0.305: v58.89,62.06 58.57,61.75 54.13,61.75 48.73,56.35 45.55,56.35 43.33,54.13 v43.33,45.87
PWM1
  Top 0.305: MC1.10 54.76,66.94 54.76,68.1 53.81,69.05 PWM1.TP 52.86,69.37 52.32,69.9 R11.1 | R11.1 52.54,70.95 | R11.1 51.41,70.95 T1.1
PWM2  (via drill 0.5)
  Top 0.305: v68.1,48.09 67.99,47.99 R12.1 67.99,45.17 T2.1 | PWM2.TP 50.95,66.19 50.63,65.87 50.63,64.6 50.93,64.31 MC1.13 53.78,64.31 56.03,62.06 v56.03,60.48
  Bottom 0.305: v68.1,48.09 63.97,48.09 56.03,56.03 v56.03,60.48
PWM3  (via drill 0.5)
  Top 0.305: MC1.12 53.36,65.11 53.49,65.24 53.49,65.56 52.54,66.51 52.54,67.14 52.22,67.46 PWM3.TP 50.32,67.46 50,67.14 50,66.51 v49.36,65.87 | v32.85,49.36 R13.1 31.58,49.26 T3.1
  Bottom 0.305: v49.36,65.87 45.24,65.87 41.43,62.06 41.43,53.17 38.89,50.63 34.12,50.63 v32.85,49.36
PWM4
  Top 0.305: MC1.11 53.94,67.65 53.49,68.1 52.86,68.1 52.22,68.73 PWM4.TP 49.68,68.73 49.05,68.1 49.05,66.83 47.56,65.34 R14.1
  Top 0.61: R14.1 44.53,65.34 T4.1
RXD0  (via drill 0.6)
  Top 0.305: v58.25,59.21 57.62,58.57 54.76,58.57 53.3,57.11 MC1.22 52.14,56.26 RXD0.TP
  Bottom 0.305: v58.25,59.21 59.52,59.21 64.92,53.81 66.83,53.81 JP5.4
SCL  (via drill 0.5)
  Top 0.254: R4.1 48.09,53.49 47.34,52.74 IC1.23
  Top 0.305: MC1.29 58.74,53.34 58.57,53.17 SCL.TP | SCL.TP 58.74,52.39 | v58.57,50.63 SCL.TP | v50.95,55.08 50.63,54.76 49.68,54.76 48.51,53.59 R4.1
  Bottom 0.305: v58.57,50.63 54.13,55.08 v50.95,55.08
SDA  (via drill 0.5)
  Top 0.254: R5.1 46.72,53.59 v46.82,53.49 46.82,52.02 IC1.24
  Top 0.305: MC1.28 57.94,53.81 57.3,53.17 SDA.TP v57.3,49.36
  Bottom 0.305: v46.82,53.49 50.95,49.36 v57.3,49.36
TXD0  (via drill 0.6)
  Top 0.305: v57.3,57.3 54.76,57.3 53.94,56.48 MC1.23 53.09,55.31 TXD0.TP
  Bottom 0.305: v57.3,57.3 57.94,57.3 62.7,52.54 JP5.3
USB+
  Top 0.254: X1.D+ R7.1 49.47,35.39 48.09,35.39
  Top 0.305: 48.09,35.39 46.82,36.67 U2.3
USB-
  Top 0.254: X1.D- 49.52,33.76 R8.1 48.66,34.61
  Top 0.305: 48.66,34.61 48.51,34.76 46.82,34.76 46.82,35.08 46.82,35.07 U2.2
V+  (via drill 0.7)
  Top 0.61: X1.VBUS 48.73,31.68 48.73,32.85 48.09,33.49 43.33,33.49 | U2.4 44.77,36.98 43.33,36.98 v42.38,36.03 42.38,34.44 43.33,33.49 | C4.1 43.33,33.49
  Bottom 0.61: JP1.3 42.38,37.3 v42.38,36.03
VBAT  (via drill 0.7)
  Top 0.305: D1.C 42.38,68.94
  Top 0.61: 56.98,74.13 M1+.TP 57.3,74.76 58.57,76.03 v88.1,93.81 | D4.C 45.12,71.91 D1.C | REXT.2 39.94,52.22 U1.1 36.35,52.22 36.03,52.54 36.03,54.44 36.35,54.76 U1.3 39.52,54.76 40.16,55.4 40.16,60.16 39.71,60.61 CIN.2 | M4+.TP 24.92,57.62 24.28,58.25 v6.18,88.42 | M2+.TP 57.3,25.23 58.25,24.28 v88.42,6.18 | M3+.TP 40.79,23.65 v11.9,6.18
  Top 1.016: CIN.2 35.58,60.61 JP2.1
  pour Top (isolate 0.356): 0,0 100,0 100,100 0,100
VCC
  Top 0.61: U3.2 37.72,43.55 C3.1 37.72,39.62 | 37.72,39.62 JP1.2 | 37.72,39.62 37.72,38.15 38.57,37.3 41.11,37.3 42.7,38.89 46.19,38.89 47.46,40.16 PPM_+5V.TP
XCK0
  Top 0.305: MC1.21 51.24,57.91 50.32,56.98 XCK0.TP

### Text on the board
tPlace: M. Kesenheimer 2012 | VBAT | VUSB | Nano | QDC MK1 | USB B
bPlace: Nano QDC MK1 | M. Kesenheimer 2012